# EAGLE design BLDC_logic_v3 (EAGLE 9.6.2)
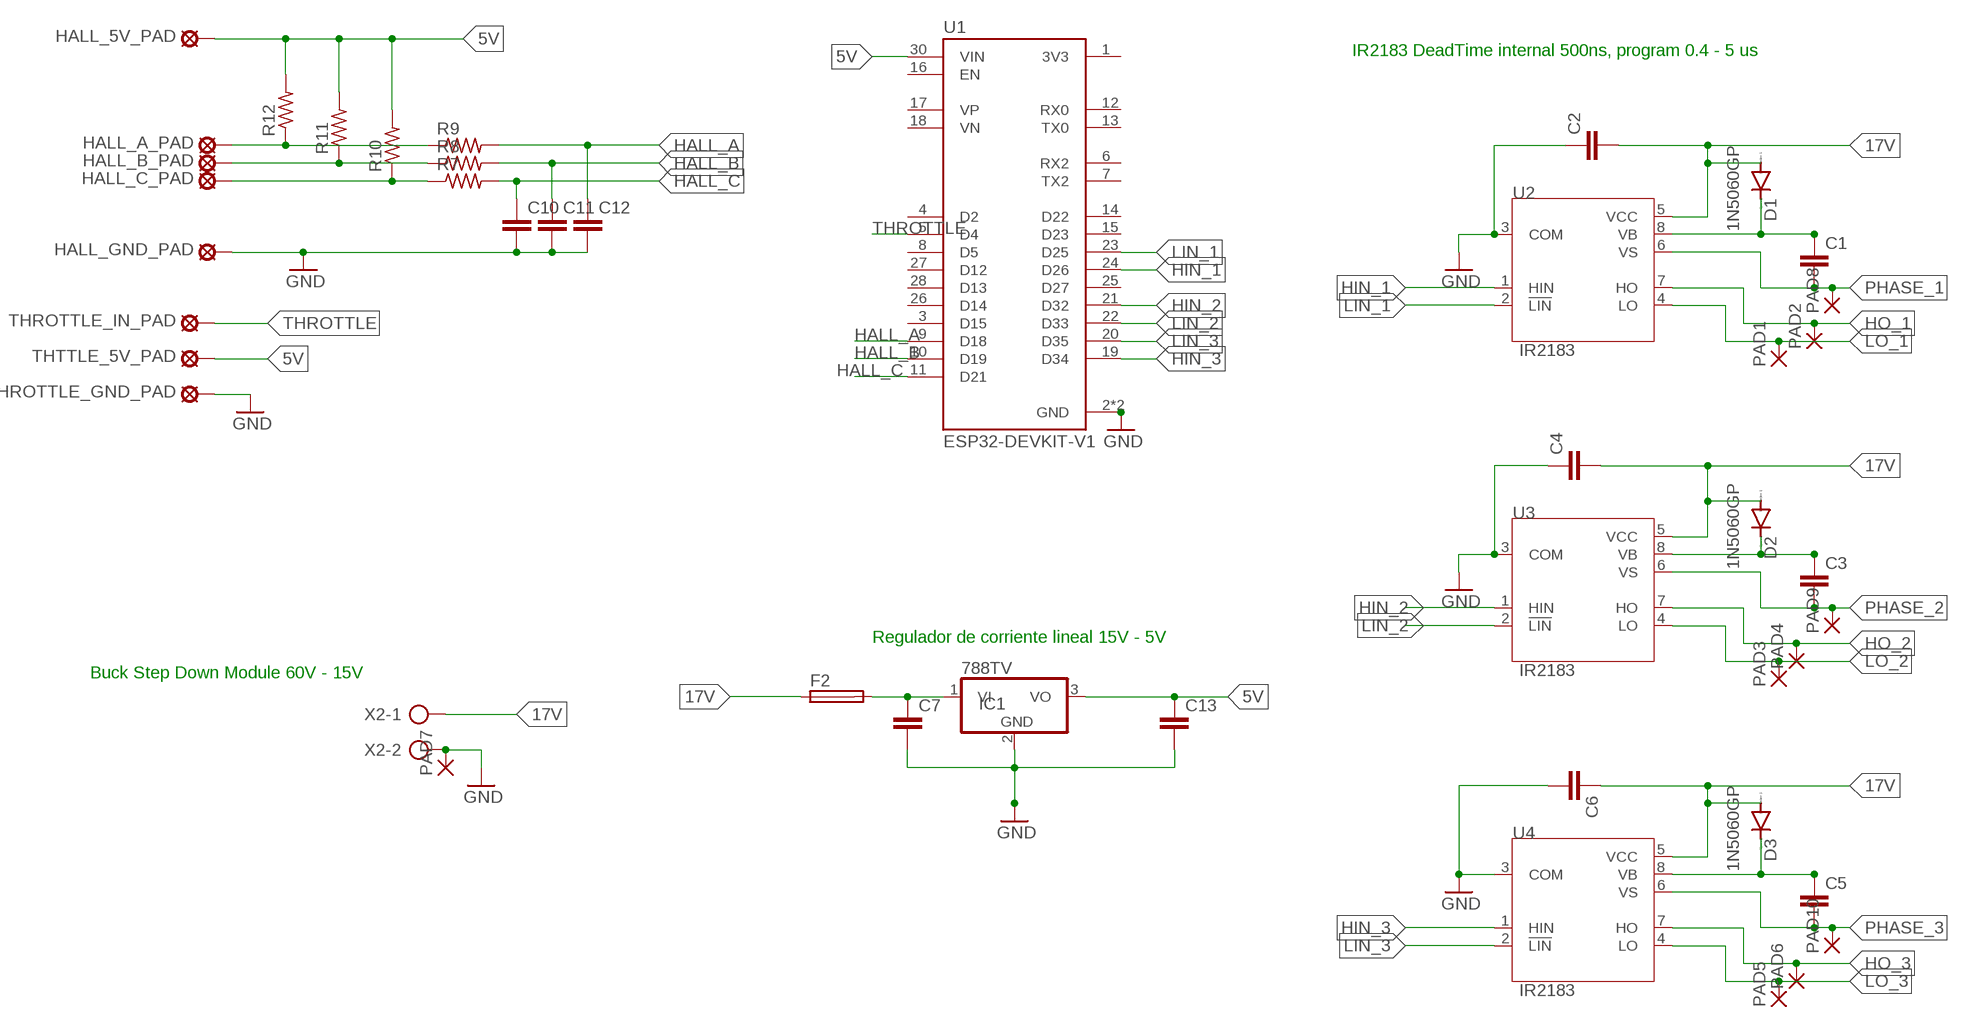
[diagram p0: schematic, sheet 1]

## Parts
C1  C-EU025-030X050  [C025-030X050]
C2  C-EU025-030X050  [C025-030X050]
C3  C-EU025-030X050  [C025-030X050]
C4  C-EU025-030X050  [C025-030X050]
C5  C-EU025-030X050  [C025-030X050]
C6  C-EU025-030X050  [C025-030X050]
C7  C-EU025-030X050  [C025-030X050]
C10  C-EU025-030X050  [C025-030X050]
C11  C-EU025-030X050  [C025-030X050]
C12  C-EU025-030X050  [C025-030X050]
C13  C-EU025-030X050  [C025-030X050]
D1  1N5060GP  [DO15-12]
D2  1N5060GP  [DO15-12]
D3  1N5060GP  [DO15-12]
F2  SH22,5  [SH22,5]
HALL_5V_PAD  MCS08  [MCS08]
HALL_A_PAD  MCS08  [MCS08]
HALL_B_PAD  MCS08  [MCS08]
HALL_C_PAD  MCS08  [MCS08]
HALL_GND_PAD  MCS08  [MCS08]
IC1  788TV  [TO220V]
PAD1  3,81/1,4  [3,81/1,4]
PAD2  3,81/1,4  [3,81/1,4]
PAD3  3,81/1,4  [3,81/1,4]
PAD4  3,81/1,4  [3,81/1,4]
PAD5  3,81/1,4  [3,81/1,4]
PAD6  3,81/1,4  [3,81/1,4]
PAD7  3,81/1,4  [3,81/1,4]
PAD8  3,81/1,4  [3,81/1,4]
PAD9  3,81/1,4  [3,81/1,4]
PAD10  3,81/1,4  [3,81/1,4]
R7  R-US_0204/7  [0204/7]
R8  R-US_0204/7  [0204/7]
R9  R-US_0204/7  [0204/7]
R10  R-US_0204/7  [0204/7]
R11  R-US_0204/7  [0204/7]
R12  R-US_0204/7  [0204/7]
THROTTLE_GND_PAD  MCS08  [MCS08]
THROTTLE_IN_PAD  MCS08  [MCS08]
THTTLE_5V_PAD  MCS08  [MCS08]
U1  ESP32-DEVKIT-V1  [MODULE_ESP32_DEVKIT_V1]
U2  IR2183  [DIP762W45P254L1092H533Q8]
U3  IR2183  [DIP762W45P254L1092H533Q8]
U4  IR2183  [DIP762W45P254L1092H533Q8]
X2  AK500/2-H  [AK500/2-H]

## Nets
5V: C13.1 HALL_5V_PAD.MP IC1.3(VO) R10.2 R11.2 R12.2 THTTLE_5V_PAD.MP U1.30(VIN)
17V: C2.2 C4.2 C6.1 D1.A D2.A D3.A F2.1 U2.5(VCC) U3.5(VCC) U4.5(VCC) X2.1
GND: C2.1 C4.1 C6.2 C7.2 C10.2 C11.2 C12.2 C13.2 HALL_GND_PAD.MP IC1.2(GND) PAD7.1(P) THROTTLE_GND_PAD.MP U1.2(GND) U1.29(GND) U2.3(COM) U3.3(COM) U4.3(COM) X2.2
HALL_A: C12.1 R9.2 U1.9(D18)
HALL_B: C11.1 R8.2 U1.10(D19)
HALL_C: C10.1 R7.2 U1.11(D21)
HIN_1: U1.24(D26) U2.1(HIN)
HIN_2: U1.21(D32) U3.1(HIN)
HIN_3: U1.19(D34) U4.1(HIN)
HO_1: PAD2.1(P) U2.7(HO)
HO_2: PAD4.1(P) U3.7(HO)
HO_3: PAD6.1(P) U4.7(HO)
LIN_1: U1.23(D25) U2.2(!LIN)
LIN_2: U1.22(D33) U3.2(!LIN)
LIN_3: U1.20(D35) U4.2(!LIN)
LO_1: PAD1.1(P) U2.4(LO)
LO_2: PAD3.1(P) U3.4(LO)
LO_3: PAD5.1(P) U4.4(LO)
N$1: C3.1 D2.C U3.8(VB)
N$2: C5.1 D3.C U4.8(VB)
N$3: C1.1 D1.C U2.8(VB)
N$13: C7.1 F2.2 IC1.1(VI)
N$14: HALL_A_PAD.MP R9.1 R12.1
N$15: HALL_B_PAD.MP R8.1 R11.1
N$16: HALL_C_PAD.MP R7.1 R10.1
PHASE_1: C1.2 PAD8.1(P) U2.6(VS)
PHASE_2: C3.2 PAD9.1(P) U3.6(VS)
PHASE_3: C5.2 PAD10.1(P) U4.6(VS)
THROTTLE: THROTTLE_IN_PAD.MP U1.5(D4)
Unconnected: U1.1(3V3) U1.3(D15) U1.4(D2) U1.6(RX2) U1.7(TX2) U1.8(D5) U1.12(RX0) U1.13(TX0) U1.14(D22) U1.15(D23) U1.16(EN) U1.17(VP) U1.18(VN) U1.25(D27) U1.26(D14) U1.27(D12) U1.28(D13)

## Notes on the sheet
- IR2183 DeadTime internal 500ns, program 0.4 - 5 us
- Regulador de corriente lineal 15V - 5V
- Buck Step Down Module 60V - 15V

## Library data of the parts
C1-C7 C10-C13 = rcl:C-EU: CAPACITOR, European symbol; SPICEPREFIX: C
D1-D3 = diode:1N5060GP: DIODE controlled avalanche rectifier
F2 = fuse:SH22,5: FUSE HOLDER grid 22,5 mm, OGN0031 8201, Schurter (Buerklin); MF: SCHURTER; MPN: 0031.8201; OC_FARNELL: 1162740; OC_NEWARK: 96F8317
HALL_5V_PAD HALL_A_PAD HALL_B_PAD HALL_C_PAD HALL_GND_PAD THROTTLE_GND_PAD THROTTLE_IN_PAD THTTLE_5V_PAD = solpad:MCS08: SOLDER PAD MC S0,8, drill 1.2 mm, distributor Buerklin, 08F130
IC1 = linear:78*: Positive VOLTAGE REGULATOR Source: http://cache.national.com/ds/LM/LM78L05.pdf http://www.fairchildsemi.com/ds/LM/LM7805.pdf
PAD1-PAD10 = wirepad:3,81/1,4: THROUGH-HOLE PAD
R7-R12 = rcl:R-US_: RESISTOR, American symbol; SPICEPREFIX: R
U1 = ESP32-DEVKIT-V1:ESP32-DEVKIT-V1: Dual core, Wi-Fi: 2.4 GHz up to 150 Mbits/s,BLE (Bluetooth Low Energy) and legacy Bluetooth, 32 bits, Up to 240 MHz Check availability <https://pricing.snapeda.com/parts/ESP32-DEVKIT-V1/Do%20it/view-part?ref=eda>; AVAILABILITY: Not in stock; DESCRIPTION: Dual core, Wi-Fi: 2.4 GHz up to 150 Mbits/s,BLE (Bluetooth Low Energy) and legacy Bluetooth, 32 bits, Up to 240 MHz; MF: Do it; MP: ESP32-DEVKIT-V1; PACKAGE: None; PRICE: None
U2-U4 = IR2183:IR2183: MOSFET DRVR 600V 2.3A 2-OUT Hi/Lo Side Half Brdg Inv/Non-Inv 8-Pin PDIP Check availability <https://pricing.snapeda.com/parts/IR2183/Infineon/view-part?ref=eda>; AVAILABILITY: In Stock; DESCRIPTION: Half-Bridge Gate Driver IC Inverting, Non-Inverting 14-SOIC; MF: Infineon; MP: IR2183; PACKAGE: DIP-8 International Rectifier; PRICE: None; PURCHASE-URL: https://pricing.snapeda.com/search/part/IR2183/?ref=eda
X2 = con-ptr500:AK500/2-H: CONNECTOR Aug. 2004 / PTR Meßtechnik: Die Bezeichnung der Serie AK505 wurde geändert. Es handelt sich hierbei um AK500 in horizontaler Ausführung.; OC_FARNELL: unknown; OC_NEWARK: unknown

## Module HOLE
Ports: 

### Library data of the parts

## Net classes
0 default: clearance 0.205 mm

## Board
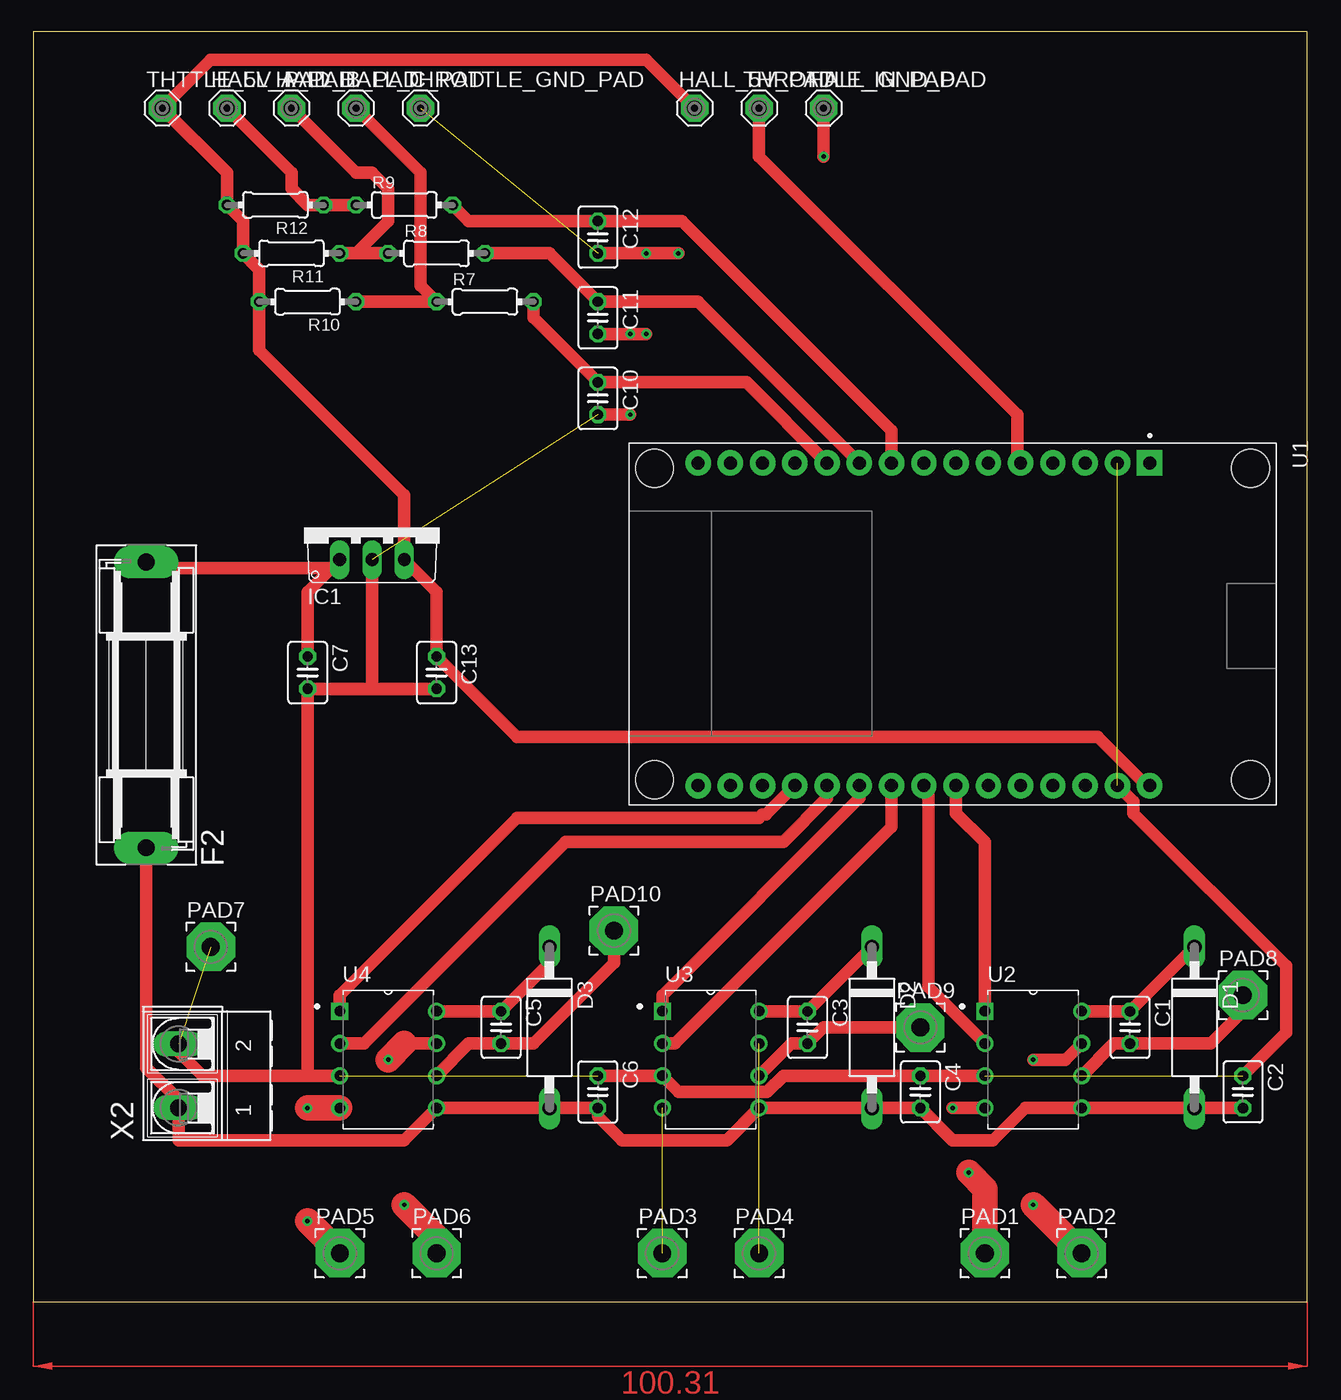
[diagram p1: board, top side]
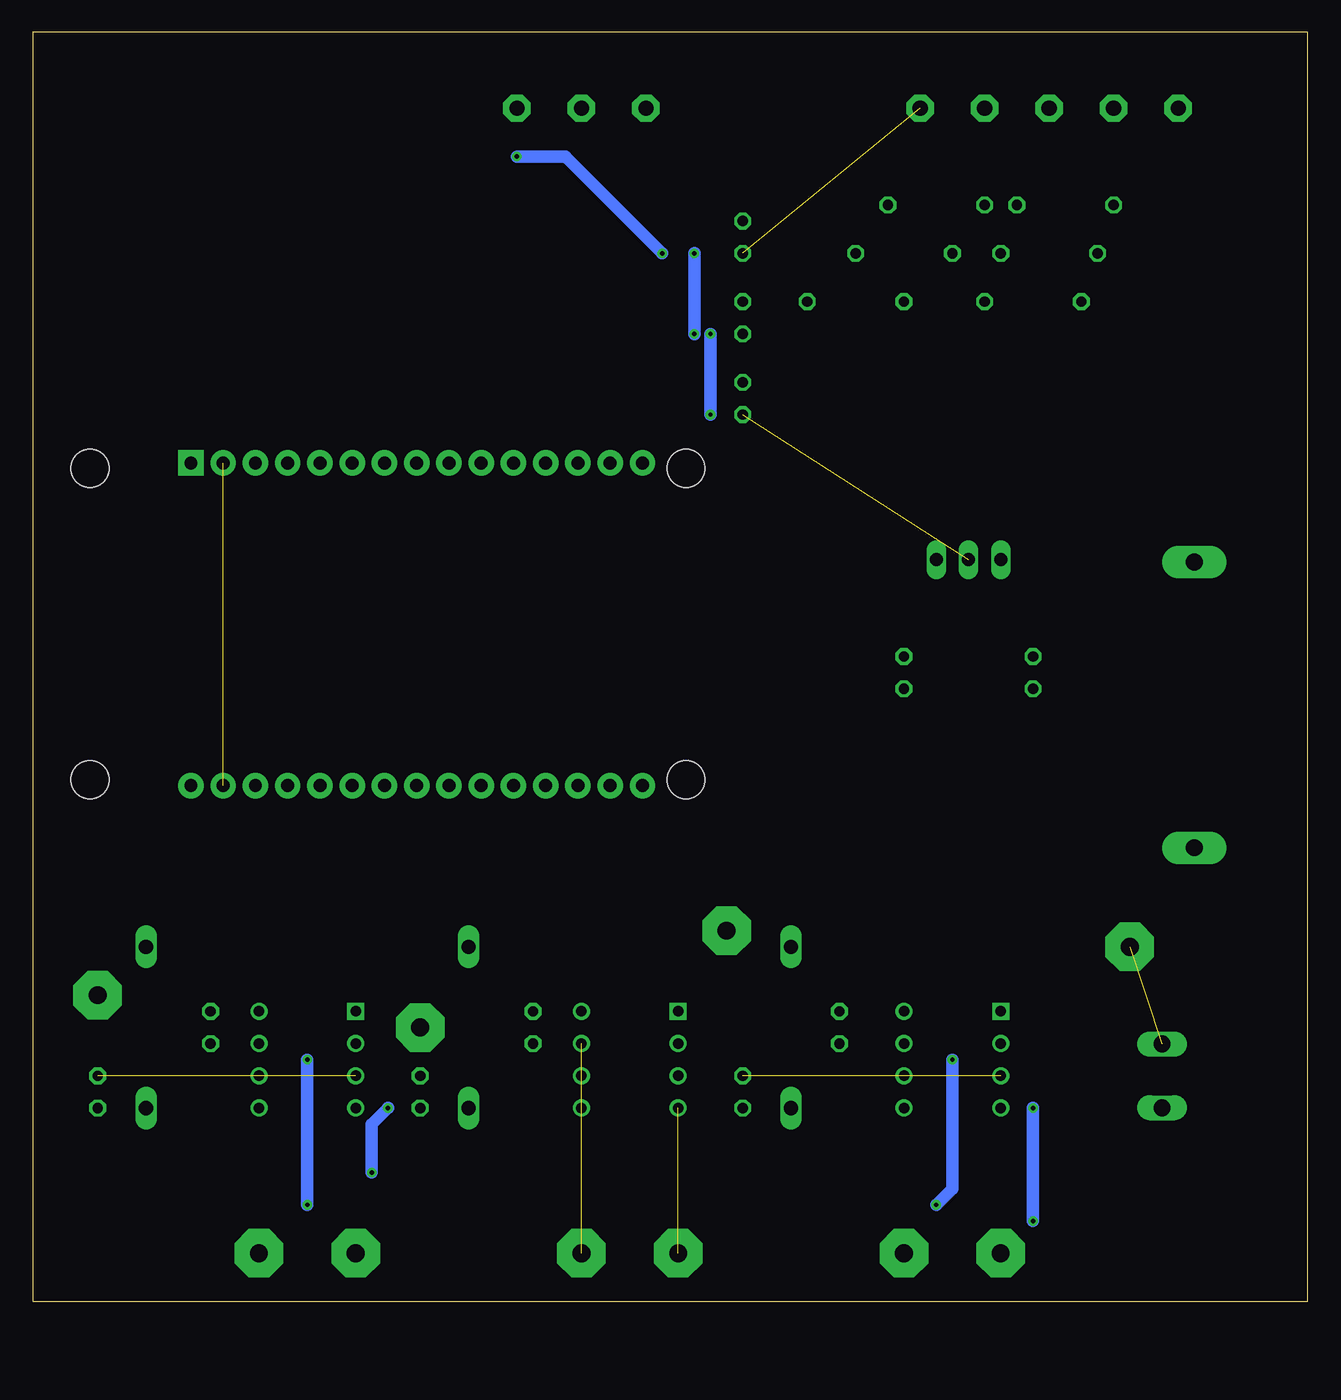
[diagram p2: board, bottom side, seen from below]

Size 100.31 x 100 mm. Coordinates in mm from the lower left corner, seen from the top.
Outline: 0,0 100.31,0 100.31,100 0,100 0,0
Copper layers (1*16): Top 0.035mm / dielectric 1.5mm / Bottom 0.035mm
Design rules "default *": minimum track width 1mm, minimum drill 0.35mm, track to track 6mil, track to pad 6mil, pad to pad 6mil, via to via 6mil, smd to smd 6mil, copper to edge 40mil, drill to drill 6mil, minimum pad ring 10mil, minimum via ring 8mil, stop-mask expansion 4mil, vias tented up to drill 0mil, thermal gap 10mil

### Footprints (pad centres in the part's own frame; a part is rotated, then mirrored left to right if it is on the bottom)
C025-030X050 = drill 0.813 octagon: 1 -1.27,0; 2 1.27,0
DO15-12 = drill 1.118 long: A 6.35,0; C -6.35,0
SH22,5 = drill 1.321 pad 2.54 long: 1 -11.252,0; 2 11.252,0
MCS08 = drill 1.194 pad 2.159 octagon: MP 0,0
TO220V = drill 1.016 long: 1 -2.54,-2.54; 2 0,-2.54; 3 2.54,-2.54
3,81/1,4 = drill 1.397 pad 3.81 octagon: 1 0,0
0204/7 = drill 0.813 octagon: 1 -3.81,0; 2 3.81,0
MODULE_ESP32_DEVKIT_V1 = drill 1.02 pad 2 square: 1 -12.7,15.515 | drill 1.02 pad 2: 2 -12.7,12.975; 3 -12.7,10.435; 4 -12.7,7.895; 5 -12.7,5.355; 6 -12.7,2.815; 7 -12.7,0.275; 8 -12.7,-2.265; 9 -12.7,-4.805; 10 -12.7,-7.345; 11 -12.7,-9.885; 12 -12.7,-12.425; 13 -12.7,-14.965; 14 -12.7,-17.505; 15 -12.7,-20.045; 16 12.7,-20.045; 17 12.7,-17.505; 18 12.7,-14.965; 19 12.7,-12.425; 20 12.7,-9.885; 21 12.7,-7.345; 22 12.7,-4.805; 23 12.7,-2.265; 24 12.7,0.275; 25 12.7,2.815; 26 12.7,5.355; 27 12.7,7.895; 28 12.7,10.435; 29 12.7,12.975; 30 12.7,15.515 | hole 3: -12.28,-23.475; 12.23,-23.475; 12.23,23.475; -12.28,23.475
DIP762W45P254L1092H533Q8 = drill 0.83 square: 1 -3.81,3.81 | drill 0.83: 2 -3.81,1.27; 3 -3.81,-1.27; 4 -3.81,-3.81; 5 3.81,-3.81; 6 3.81,-1.27; 7 3.81,1.27; 8 3.81,3.81
AK500/2-H = drill 1.321 long: 1 -2.515,0; 2 2.515,0

### Placement (x,y rotation side)
C1  86.36,21.59 270 top
C2  95.25,16.51 270 top
C3  60.96,21.59 270 top
C4  69.85,16.51 270 top
C5  36.83,21.59 270 top
C6  44.45,16.51 90 top
C7  21.59,49.53 270 top
C10  44.45,71.12 270 top
C11  44.45,77.47 270 top
C12  44.45,83.82 270 top
C13  31.75,49.53 270 top
D1  91.44,21.59 270 top
D2  66.04,21.59 270 top
D3  40.64,21.59 270 top
F2  8.89,46.99 90 top
HALL_5V_PAD  52.07,93.98 0 top
HALL_A_PAD  15.24,93.98 0 top
HALL_B_PAD  20.32,93.98 0 top
HALL_C_PAD  25.4,93.98 0 top
HALL_GND_PAD  62.23,93.98 0 top
IC1  26.67,60.96 0 top
PAD1  74.93,3.81 0 top
PAD2  82.55,3.81 0 top
PAD3  49.53,3.81 0 top
PAD4  57.15,3.81 0 top
PAD5  24.13,3.81 0 top
PAD6  31.75,3.81 0 top
PAD7  13.97,27.94 0 top
PAD8  95.25,24.13 0 top
PAD9  69.85,21.59 0 top
PAD10  45.72,29.21 0 top
R7  35.56,78.74 0 top
R8  31.75,82.55 0 top
R9  29.21,86.36 0 top
R10  21.59,78.74 180 top
R11  20.32,82.55 180 top
R12  19.05,86.36 180 top
THROTTLE_GND_PAD  30.48,93.98 0 top
THROTTLE_IN_PAD  57.15,93.98 0 top
THTTLE_5V_PAD  10.16,93.98 0 top
U1  72.39,53.34 270 top
U2  78.74,19.05 0 top
U3  53.34,19.05 0 top
U4  27.94,19.05 0 top
X2  11.43,17.78 90 top

### Tracks (layer width: path | path; a pad name or v marks a point on that pad's centre or on a via)
5V
  Top 1: U1.30 87.63,40.64 83.82,44.45 38.1,44.45 C13.1 31.75,55.88 IC1.3 29.21,63.5 17.78,74.93 R10.2 17.78,81.28 R11.2 16.51,85.09 R12.2 15.24,88.9 THTTLE_5V_PAD.MP 13.97,97.79 48.26,97.79 HALL_5V_PAD.MP
17V
  Top 1: C2.2 D1.A U2.5 78.1,15.24 75.56,12.7 72.39,12.7 C4.2 D2.A U3.5 54.61,12.7 46.36,12.7 44.45,14.61 C6.1 D3.A U4.5 29.21,12.7 11.43,12.7 X2.1 11.43,15.88 8.89,18.41 F2.1
GND  (via drill 0.35)  (6 unrouted)
  Top 1: 85.09,66.04 U1.2 | U2.3 C4.1 59.06,17.78 57.78,16.51 50.8,16.51 U3.3 C6.2 | C2.1 98.68,21.21 98.68,26.42 86.63,38.46 86.63,39.37 U1.29 | 21.59,17.78 13.34,17.78 11.43,19.68 X2.2 | 21.59,17.78 U4.3 | C13.2 26.67,48.26 | 26.67,48.26 C7.2 21.59,17.78 | 26.67,48.26 IC1.2 | C10.2 v46.99,69.85 | C11.2 v46.99,76.2 v48.26,76.2 | C12.2 v48.26,82.55 v50.8,82.55 | v62.23,90.17 HALL_GND_PAD.MP
  Bottom 1: v46.99,69.85 v46.99,76.2 | v48.26,76.2 v48.26,82.55 | v50.8,82.55 58.42,90.17 v62.23,90.17
HALL_A
  Top 1: R9.2 34.29,85.09 C12.1 51.08,85.09 67.59,68.58 U1.9
HALL_B
  Top 1: R8.2 40.64,82.55 C11.1 52.34,78.74 U1.10
HALL_C
  Top 1: R7.2 39.37,77.47 C10.1 56.16,72.39 U1.11
HIN_1
  Top 1: U2.1 74.93,36.2 72.66,38.46 U1.24
HIN_2
  Top 1: U3.1 49.53,24.13 65.05,39.65 U1.21
HIN_3
  Top 1: U4.1 24.13,24.13 38.1,38.1 57.15,38.1 57.42,38.38 57.7,38.38 U1.19
HO_1  (via drill 0.35)
  Top 1: U2.7 81.28,19.05 v78.74,19.05
  Top 2: v78.74,7.62 PAD2.1
  Bottom 1: v78.74,19.05 v78.74,7.62
HO_2  (1 unrouted)
HO_3  (via drill 0.35)
  Top 1: U4.7 29.21,20.32
  Top 2: 29.21,20.32 v27.94,19.05 | v29.21,7.62 31.75,5.08 PAD6.1
  Bottom 1: v27.94,19.05 27.94,8.89 v29.21,7.62
LIN_1
  Top 1: U2.2 70.49,24.77 70.49,40.28 U1.23
LIN_2
  Top 1: U3.2 50.53,20.32 67.59,37.38 U1.22
LIN_3
  Top 1: U4.2 26.03,20.32 41.91,36.2 59.06,36.2 62.5,39.65 U1.20
LO_1  (via drill 0.35)
  Top 1: v72.39,15.24 U2.4
  Top 2: PAD1.1 74.93,8.89 v73.66,10.16
  Bottom 1: v73.66,10.16 73.66,13.97 v72.39,15.24
LO_2  (1 unrouted)
LO_3  (via drill 0.35)
  Top 2: U4.4 v21.59,15.24 | v21.59,6.35 PAD5.1
  Bottom 1: v21.59,15.24 v21.59,6.35
N$1
  Top 1: U3.8 C3.1 D2.C
N$2
  Top 1: U4.8 C5.1 40.64,26.67 D3.C
N$3
  Top 1: U2.8 C1.1 D1.C
N$13
  Top 1: C7.1 21.59,55.88 23.5,57.78 | 23.5,57.78 8.89,57.78 F2.2 | 23.5,57.78 IC1.1
N$14
  Top 1: HALL_A_PAD.MP 20.32,88.9 20.32,87.63 21.59,86.36 R12.1 R9.1
N$15
  Top 1: R8.1 25.4,82.55 | 25.4,82.55 R11.1 | HALL_B_PAD.MP 25.4,88.9 26.67,88.9 27.94,87.63 27.94,85.09 25.4,82.55
N$16
  Top 1: HALL_C_PAD.MP 30.48,88.9 30.48,80.01 R7.1 R10.1
PHASE_1
  Top 1: U2.6 85.09,20.32 C1.2 92.71,20.32 95.25,22.86 PAD8.1
PHASE_2
  Top 1: U3.6 59.69,20.32 C3.2 62.23,21.59 PAD9.1
PHASE_3
  Top 1: U4.6 34.29,20.32 C5.2 39.37,20.32 45.72,26.67 PAD10.1
THROTTLE
  Top 1: U1.5 77.47,66.31 77.47,69.85 57.15,90.17 THROTTLE_IN_PAD.MP
(copper drawn outside any net)
  shapes: Top area x1